# EAGLE design controller14 (EAGLE 9.3.0)

## Sheet 1 of 2
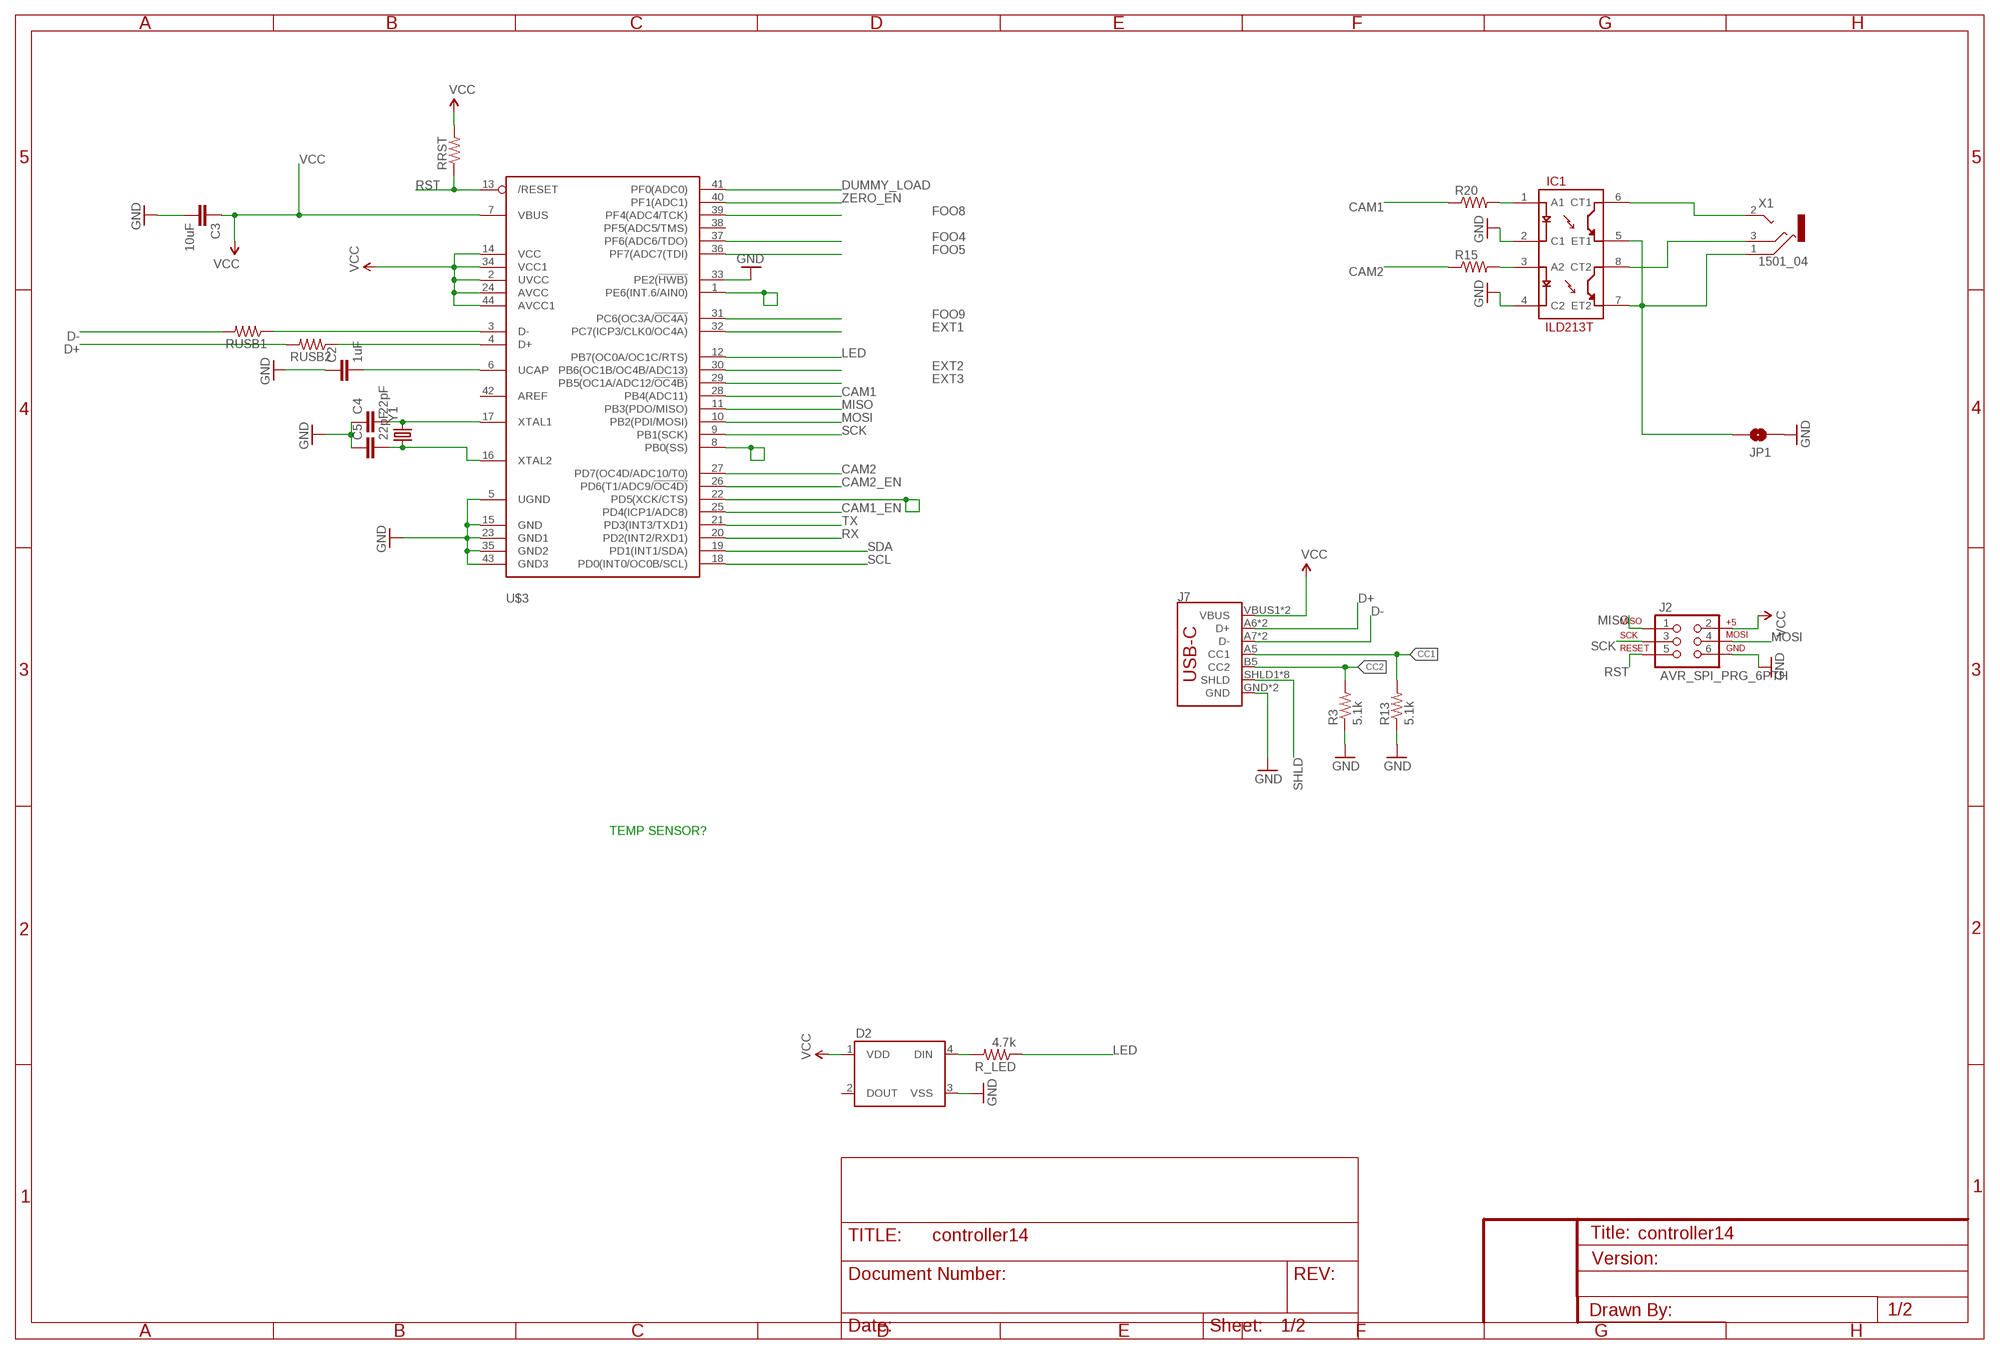
[diagram p0: schematic, sheet 1]

### Parts
C2  1uF  CAP1206  [1206]
C3  10uF  CAP1206  [1206]
C4  22pF  CAP1206  [1206]
C5  22pF  CAP1206  [1206]
D2  WS2812B  [WS2812B]
IC1  ILD213T  [SO08]
J2  AVR_SPI_PRG_6PTH  [2X3]
J7  USB_C16PIN  [USB-C-16P]
JP1  JUMPER-PAD-2-NOYES_SILK  [PAD-JUMPER-2-NO_YES_SILK]
R3  5.1k  RESISTOR1206  [1206]
R13  5.1k  RESISTOR1206  [1206]
R15  RESISTOR1206  [1206]
R20  RESISTOR1206  [1206]
R_LED  4.7k  RESISTOR1206  [1206]
RRST  RESISTOR1206  [1206]
RUSB1  RESISTOR1206  [1206]
RUSB2  RESISTOR1206  [1206]
U$3  ATMEGA32U4-AU  [TQFP44]
X1  1501_04  [1501_05]
Y1  CRYSTALCRYSTAL-SMD-5X3-16MHZ  [CRYSTAL-SMD-5X3]

### Nets
CAM1: R20.1 U$3.28(PB4(ADC11))
CAM1_EN: U$3.25(PD4(ICP1/ADC8)) ; also sheet 2
CAM2: R15.1 U$3.27(PD7(OC4D/ADC10/T0))
CAM2_EN: U$3.26(PD6(T1/ADC9/!OC4D)) ; also sheet 2
CC1: J7.A5(CC1) R13.2
CC2: J7.B5(CC2) R3.2
D+: J7.A6(D+) J7.B6(D+) RUSB2.2
D-: J7.A7(D-) J7.B7(D-) RUSB1.2
DUMMY_LOAD: U$3.41(PF0(ADC0)) ; also sheet 2
EXT1: U$3.32(PC7(ICP3/CLK0/OC4A))
EXT2: U$3.30(PB6(OC1B/OC4B/ADC13))
EXT3: U$3.29(PB5(OC1A/ADC12/!OC4B))
FOO4: U$3.37(PF6(ADC6/TDO))
FOO5: U$3.36(PF7(ADC7(TDI))
FOO8: U$3.39(PF4(ADC4/TCK))
FOO9: U$3.31(PC6(OC3A/!OC4A))
GND: C2.1 C3.2 C4.1 C5.1 D2.3(VSS) IC1.2(C1) IC1.4(C2) J2.6 J7.GND J7.GND2(GND) JP1.1 R3.1 R13.1 U$3.5(UGND) U$3.15(GND) U$3.23(GND1) U$3.33(PE2(!HWB)) U$3.35(GND2) U$3.43(GND3) ; also sheet 2
LED: R_LED.1 U$3.12(PB7(OC0A/OC1C/RTS))
MISO: J2.1 U$3.11(PB3(PDO/MISO))
MOSI: J2.4 U$3.10(PB2(PDI/MOSI))
N$4: RUSB1.1 U$3.3(D-)
N$5: RUSB2.1 U$3.4(D+)
N$7: D2.4(DIN) R_LED.2
N$8: C4.2 U$3.17(XTAL1) Y1.3
N$9: C5.2 U$3.16(XTAL2) Y1.1
N$12: IC1.6(CT1) X1.2
N$13: IC1.8(CT2) X1.3
N$14: U$3.8(PB0(SS))
N$15: IC1.3(A2) R15.2
N$16: U$3.1(PE6(INT.6/AIN0))
N$17: U$3.22(PD5(XCK/CTS))
N$19: IC1.1(A1) R20.2
N$20: C2.2 U$3.6(UCAP)
N$34: IC1.5(ET1) IC1.7(ET2) JP1.2 X1.1
RST: J2.5 RRST.1 U$3.13(/RESET)
RX: U$3.20(PD2(INT2/RXD1)) ; also sheet 2
SCK: J2.3 U$3.9(PB1(SCK))
SCL: U$3.18(PD0(INT0/OC0B/SCL))
SDA: U$3.19(PD1(INT1/SDA))
SHLD: J7.SHLD1(SHLD) J7.SHLD2(SHLD) J7.SHLD3(SHLD) J7.SHLD4(SHLD) J7.SHLD5(SHLD) J7.SHLD6(SHLD) J7.SHLD7(SHLD) J7.SHLD8(SHLD)
TX: U$3.21(PD3(INT3/TXD1)) ; also sheet 2
VCC [power]: C3.1 D2.1(VDD) J2.2 J7.VBUS1(VBUS) J7.VBUS2(VBUS) RRST.2 U$3.2(UVCC) U$3.7(VBUS) U$3.14(VCC) U$3.24(AVCC) U$3.34(VCC1) U$3.44(AVCC1) ; also sheet 2
ZERO_EN: U$3.40(PF1(ADC1)) ; also sheet 2
Unconnected: D2.2(DOUT) U$3.38(PF5(ADC5/TMS)) U$3.42(AREF)

### Notes on the sheet
- TEMP SENSOR?

## Sheet 2 of 2
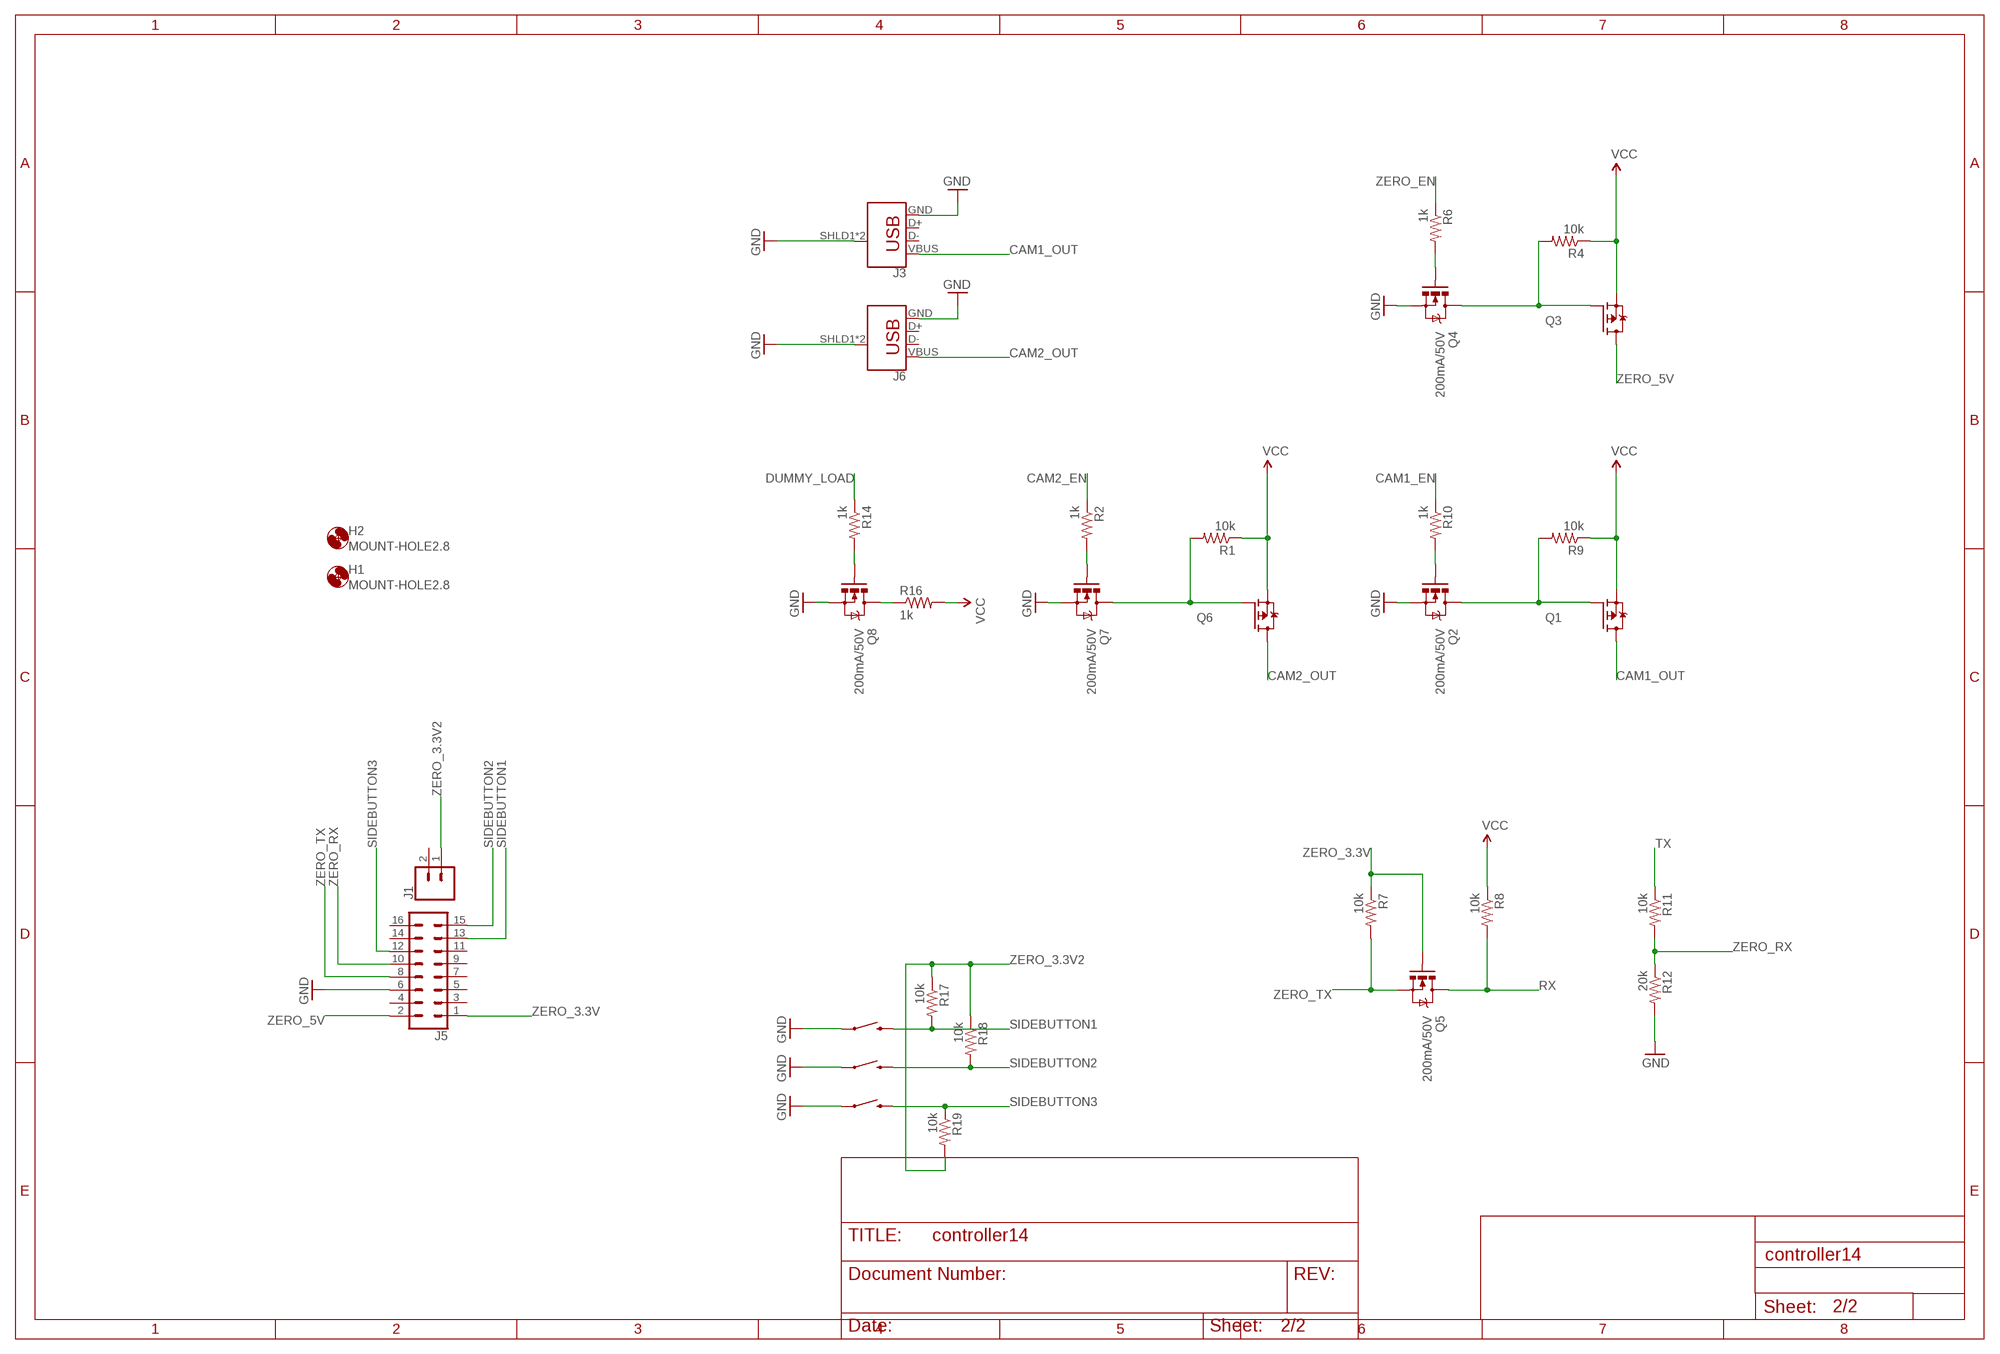
[diagram p1: schematic, sheet 2]

### Parts
H1  MOUNT-HOLE2.8  [2,8]
H2  MOUNT-HOLE2.8  [2,8]
J1  CONN_02  [1X02]
J3  USB_A_SMT_FEMALE  [USB-A-S-SILK-FEMALE]
J5  CONN_08X2  [2X8]
J6  USB_A_SMT_FEMALE  [USB-A-S-SILK-FEMALE]
Q1  FDD4141TO252  [TO252]
Q2  200mA/50V  MOSFET-NCHANNELBSS138  [SOT23-3]
Q3  FDD4141TO252  [TO252]
Q4  200mA/50V  MOSFET-NCHANNELBSS138  [SOT23-3]
Q5  200mA/50V  MOSFET-NCHANNELBSS138  [SOT23-3]
Q6  FDD4141TO252  [TO252]
Q7  200mA/50V  MOSFET-NCHANNELBSS138  [SOT23-3]
Q8  200mA/50V  MOSFET-NCHANNELBSS138  [SOT23-3]
R1  10k  RESISTOR1206  [1206]
R2  1k  RESISTOR1206  [1206]
R4  10k  RESISTOR1206  [1206]
R6  1k  RESISTOR1206  [1206]
R7  10k  RESISTOR1206  [1206]
R8  10k  RESISTOR1206  [1206]
R9  10k  RESISTOR1206  [1206]
R10  1k  RESISTOR1206  [1206]
R11  10k  RESISTOR1206  [1206]
R12  20k  RESISTOR1206  [1206]
R14  1k  RESISTOR1206  [1206]
R16  1k  RESISTOR1206  [1206]
R17  10k  RESISTOR1206  [1206]
R18  10k  RESISTOR1206  [1206]
R19  10k  RESISTOR1206  [1206]
S3  MOMENTARY-SWITCH-SPST-PTH-RIGHT-ANGLE-KIT  [TACTILE_SWITCH_PTH_RIGHT_ANGLE_KIT]
S4  MOMENTARY-SWITCH-SPST-PTH-RIGHT-ANGLE-KIT  [TACTILE_SWITCH_PTH_RIGHT_ANGLE_KIT]
S5  MOMENTARY-SWITCH-SPST-PTH-RIGHT-ANGLE-KIT  [TACTILE_SWITCH_PTH_RIGHT_ANGLE_KIT]

### Nets
CAM1_EN: R10.1 ; also sheet 1
CAM1_OUT: J3.VBUS Q1.3(D)
CAM2_EN: R2.1 ; also sheet 1
CAM2_OUT: J6.VBUS Q6.3(D)
DUMMY_LOAD: R14.1 ; also sheet 1
GND: J3.GND J3.SHLD1(SHIELD) J3.SHLD2(SHIELD) J5.6 J6.GND J6.SHLD1(SHIELD) J6.SHLD2(SHIELD) Q2.2(S) Q4.2(S) Q7.2(S) Q8.2(S) R12.2 S3.1 S4.1 S5.1 ; also sheet 1
N$1: Q1.1(G) Q2.3(D) R9.2
N$2: Q4.1(G) R6.2
N$3: Q3.1(G) Q4.3(D) R4.2
N$6: Q2.1(G) R10.2
N$10: Q8.1(G) R14.2
N$11: Q8.3(D) R16.1
N$18: Q7.1(G) R2.2
N$21: Q6.1(G) Q7.3(D) R1.2
RX: Q5.3(D) R8.2 ; also sheet 1
SIDEBUTTON1: J5.13 R17.2 S5.2
SIDEBUTTON2: J5.15 R18.2 S4.2
SIDEBUTTON3: J5.12 R19.1 S3.2
TX: R11.1 ; also sheet 1
VCC [power]: Q1.2(S) Q3.2(S) Q6.2(S) R1.1 R4.1 R8.1 R9.1 R16.2 ; also sheet 1
ZERO_3.3V: J5.1 Q5.1(G) R7.1
ZERO_3.3V2: J1.1 R17.1 R18.1 R19.2
ZERO_5V [power]: J5.2 Q3.3(D)
ZERO_EN: R6.1 ; also sheet 1
ZERO_RX: J5.10 R11.2 R12.1
ZERO_TX: J5.8 Q5.2(S) R7.2
Unconnected: J1.2 J3.D+ J3.D- J5.3 J5.4 J5.5 J5.7 J5.9 J5.11 J5.14 J5.16 J6.D+ J6.D-

## Library data of the parts
C2 = SparkFun-Capacitors:CAP: Capacitor Standard 0603 ceramic capacitor, and 0.1" leaded capacitor.
C3-C5 = SparkFun-Passives:CAP: Capacitor Standard 0603 ceramic capacitor, and 0.1" leaded capacitor.
D2 = SparkFun-LED:WS2812B: WS2812B - Intelligent control LED integrated light source Technical Specifications: Power Supply Voltage (VDD): 3.5 to 5.3 V Input Voltage (VI): -0.5 to VDD+0.5 V Operating Junction Temperature (Topt): -25°C to +80°C Storage Temperature Range (Tstg): -55°C to +150°C; PROD_ID: DIO-12503
H1 H2 = holes:MOUNT-HOLE: MOUNTING HOLE with drill center marker
IC1 = SparkFun-DiscreteSemi:ILD213T: Dual optoisolator.
J1 = SparkFun-Connectors:CONN_02: Multi connection point. Often used as Generic Header-pin footprint for 0.1 inch spaced/style header connections On any of the 0.1 inch spaced packages, you can populate with these: Break Away Headers - Straight <https://www.sparkfun.com/products/116> (PRT-00116) Break Away Male Headers - Right Angle <https://www.sparkfun.com/products/553> (PRT-00553) Female Headers <https://www.sparkfun.com/products/115> (PRT-00115) Break Away Headers - Machine Pin <https://www.sparkfun.com/products/117> (PRT-00117) Break Away Female Headers - Swiss Machine Pin <https://www.sparkfun.com/products/743> (PRT-00743) For SCREWTERMINALS and SPRING TERMINALS visit here: Screw Terimnals on SparkFun.com <https://www.sparkfun.com/search/results?term=Screw+Terminals> (5mm/3.5mm/2.54mm spacing) This device is also useful as a general connection point to wire up your design to another part of your project. Our various solder wires solder well into these plated through hole pads. Hook-Up Wire - Assortment (Stranded, 22 AWG) <https://www.sparkfun.com/products/11375> (PRT-11375) Hook-Up Wire - Assortment (Solid Core, 22 AWG) <https://www.sparkfun.com/products/11367> (PRT-11367) View the entire wire category on our website here <https://www.sparkfun.com/categories/141> Special notes: Molex polarized connector foot print use with: PRT-08233 with associated crimp pins and housings. 2.54_SCREWTERM for use with PRT-10571. 3.5mm Screw Terminal footprints for PRT-08084 5mm Screw Terminal footprints for use with PRT-08432
J2 = SparkFun-Connectors:AVR_SPI_PRG_6: AVR ISP 6 Pin This is the reduced ISP connector for AVR programming. Common on Arduino. This footprint will take up less PCB space and can be used with a 10-pin to 6-pin adapter such as SKU: BOB-08508 **Special note about "TEST_POINT" package. The stop mask is on the top side, so if you want your programming test points to be on the bottom of your board, make sure to place this package on the bottom side of the board. This also ensure that the orientation to program from the bottom side will be correct.
J3 J6 = SparkFun-Connectors:USB_A: USB-A Connector Male and female variants, as well as PTH and SMT variants SparkFun Products: SparkFun XBee Explorer Dongle <https://www.sparkfun.com/products/11697> PTH Male SparkFun MicroView-USB Programmer <https://www.sparkfun.com/products/12924> SMT Male SparkFun USB Type A Female Breakout <https://www.sparkfun.com/products/12700> SMT Female; PROD_ID: CONN-09520; SF_ID: PRT-09011
J5 = SparkFun-Connectors:CONN_08X2: Multi connection point. Often used as Generic Header-pin footprint for 0.1 inch spaced/style header connections You can populate with any combo of single row headers, but if you'd like an exact match, check this: Header - 2x8 (Male, 0.1") <https://www.sparkfun.com/products/13156> (PRT-13156) On any of the 0.1 inch spaced packages, you can populate with these: Break Away Headers - Straight <https://www.sparkfun.com/products/116> (PRT-00116) Break Away Male Headers - Right Angle <https://www.sparkfun.com/products/553> (PRT-00553) Female Headers <https://www.sparkfun.com/products/115> (PRT-00115) Break Away Headers - Machine Pin <https://www.sparkfun.com/products/117> (PRT-00117) Break Away Female Headers - Swiss Machine Pin <https://www.sparkfun.com/products/743> (PRT-00743)
J7 = SparkFun-Connectors:USB_C: USB Type C 16Pin Connector Super Speed pins not available on the 16-pin purely SMD connector so this part is best for USB 2.0 implementations. D1 and D2 are tied together enabling D+/- no matter which way the cable is plugged into the connector. The two channel configuration pins (CC1/2) are exposed. These are normally connected to ground via 5.1k resistors but can be reconfigured for high current/high power applications.; PROD_ID: CONN-14122
JP1 = SparkFun-Passives:JUMPER-PAD-2-NO
Q1 Q3 Q6 = transistor-fet:FDD4141: P-Channel PowerTrench® MOSFET Source: FDD4141.pdf
Q2 Q4 Q5 Q7 Q8 = SparkFun-DiscreteSemi:MOSFET-NCHANNEL: Common NMOSFET Parts MFG P/N Store ID Prod ID FDD8780 TRANS-09984 SI7820DN TRANS-11055 FDS6630A IC-08089 2N7002PW TRANS-11151 FQP30N06L COM-10213 TRANS-10060 BSS123LT1G TRANS-08345 BSS138 TRANS-00830 BS170 2N7000; PROD_ID: TRANS-00830
R1 R2 R4 R6-R12 R14 R16-R19 R_LED = SparkFun-Resistors:RESISTOR: Resistor Basic schematic elements and footprints for 0603, 1206, and PTH resistors.
R3 R13 R15 R20 RRST RUSB1 RUSB2 = SparkFun-Passives:RESISTOR: Resistor Basic schematic elements and footprints for 0603, 1206, and PTH resistors.
S3-S5 = SparkFun-Switches:MOMENTARY-SWITCH-SPST: Momentary Switch (Pushbutton) - SPST Normally-open (NO) SPST momentary switches (buttons, pushbuttons). Variants PTH-12MM - 12mm square, through-hole Momentary Pushbutton Switch - 12mm Square <https://www.sparkfun.com/products/9190> (COM-09190) PTH-6.0MM, PTH-6.0MM-KIT - 6.0mm square, through-hole Mini Pushbutton Switch <https://www.sparkfun.com/products/97> (COM-00097) KIT package intended for soldering kit's - only one side of pads' copper is exposed. PTH-RIGHT-ANGLE-KIT - Right-angle, through-hole Right Angle Tactile Button <https://www.sparkfun.com/products/10791> - Used on SparkFun BigTime Watch Kit <https://www.sparkfun.com/products/11734> SMD-12MM - 12mm square, surface-mount Tactile Button - SMD (12mm) <https://www.sparkfun.com/products/12993> (COM-12993) Used on SparkFun PicoBoard <https://www.sparkfun.com/products/11888> SMD-4.5MM - 4.5mm Square Trackball Switch Used on SparkFun Blackberry Trackballer Breakout <https://www.sparkfun.com/products/13169> SMD-4.6MMX2.8MM - 4.60mm x 2.80mm, surface mount Used on SparkFun SAMD21 Mini Breakout <https://www.sparkfun.com/products/13664> SMD-5.2MM, SMD-5.2-REDUNDANT - 5.2mm square, surface-mount Mini Pushbutton Switch - SMD <https://www.sparkfun.com/products/8720> (COM-08720) Used on Arduino Pro Mini <https://www.sparkfun.com/products/11114> REDUNDANT package connects both switch circuits together SMD-6.0X3.5MM - 6.0 x 3.5mm, surface mount Momentary Reset Switch SMD <https://www.sparkfun.com/products/8229> (COM-08229) SMD-6.2MM-TALL - 6.2mm square, surface mount Tactile Button - SMD (6mm) <https://www.sparkfun.com/products/12992> Used on SparkFun Digital Sandbox <https://www.sparkfun.com/products/12651> SMD-RIGHT-ANGLE - Right-angle, surface mount Used on SparkFun Block for Intel® Edison - Arduino <https://www.sparkfun.com/products/13036>; PROD_ID: CONN-10672; SF_SKU: COM-10791
U$3 = adafruit:ATMEGA32U4: http://www.ladyada.net/library/eagle
X1 = con-lumberg:1501_0*: Jack connectors according to JISC 6560, 2.5 mm Klinkensteckverbinder nach JISC 6560, 2,5 mm Source: http://www.lumberg.com/Produkte/PDFs/1501_05.pdfedit 1501_03 http://www.lumberg.com/Produkte/PDFs/1501_06.pdf; OC_FARNELL: 1216977; OC_NEWARK: unknown
Y1 = SparkFun-FreqCtrl:CRYSTAL: Various standard crystals. Proven footprints.; PROD_ID: XTAL-08218

## Net classes
0 default: width 0.254 mm, clearance 0.254 mm
1 power: width 0.381 mm, clearance 0.254 mm
2 camera_power: width 0.66 mm, clearance 0.254 mm
3 usbsignal: width 0.254 mm, clearance 0.203 mm

## Board
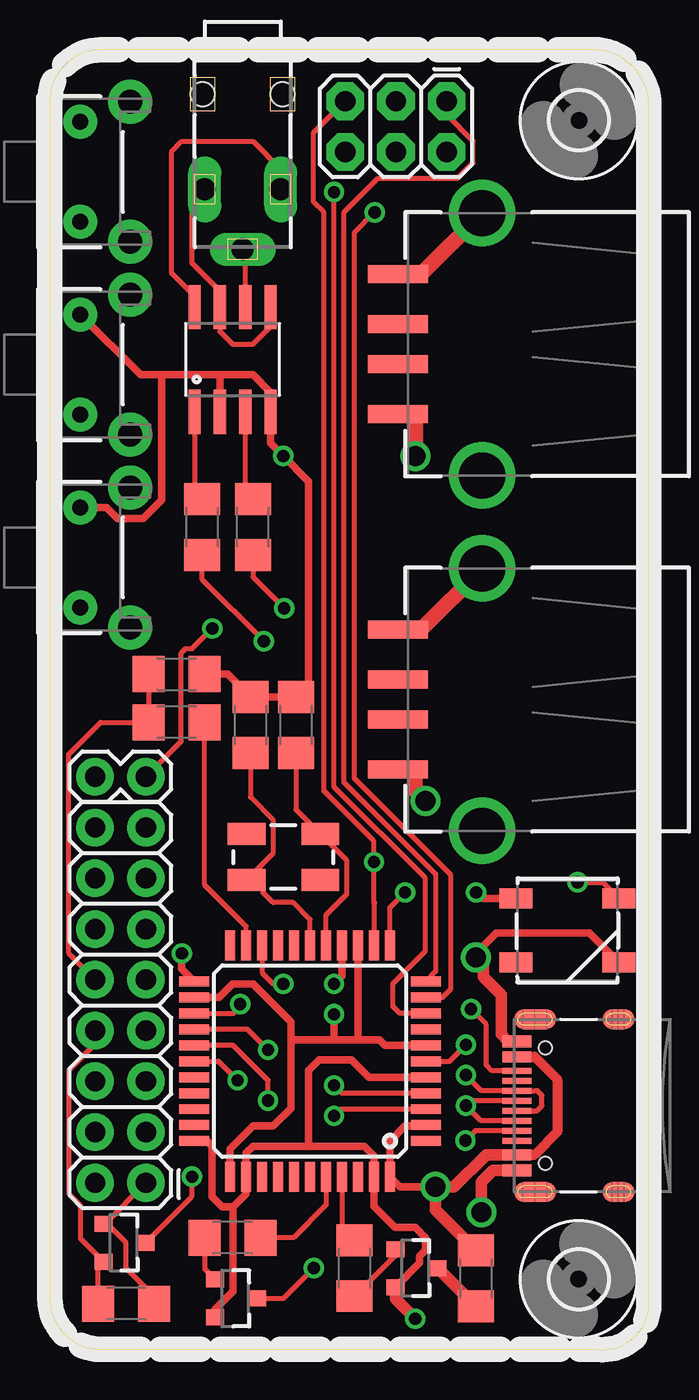
[diagram p2: board, top side]
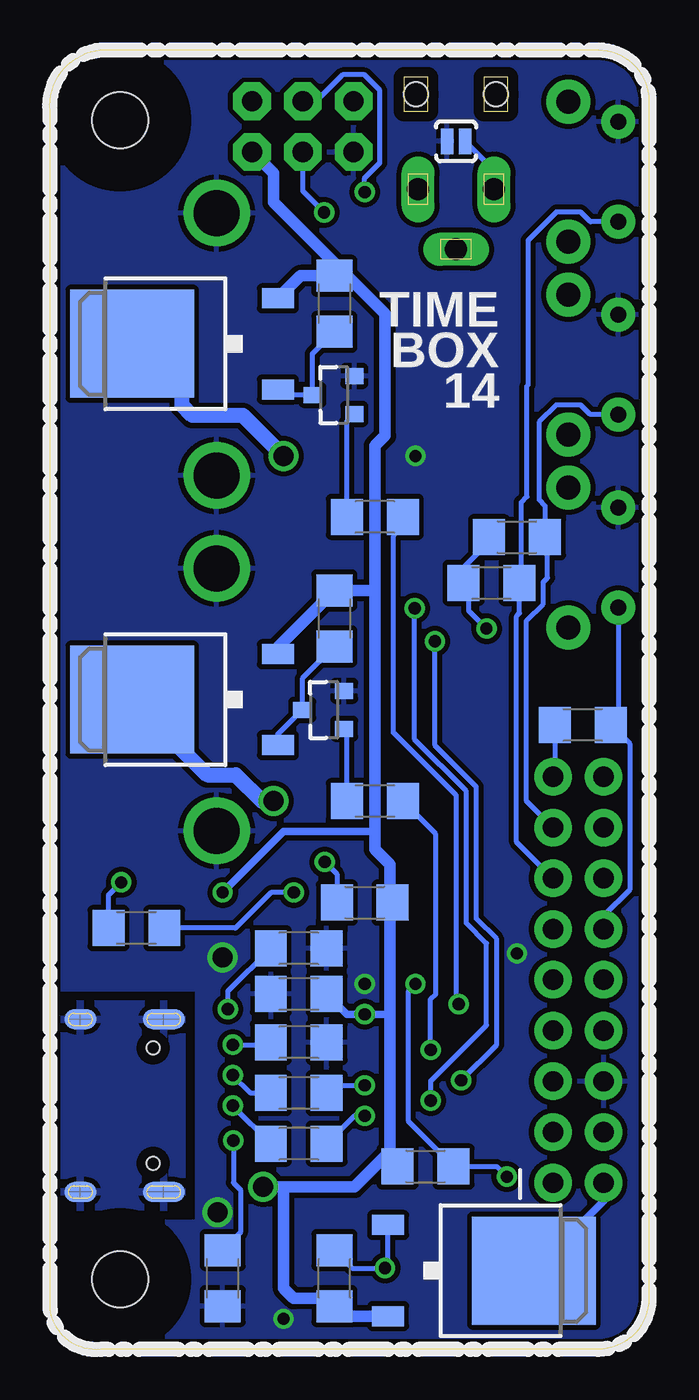
[diagram p3: board, bottom side, seen from below]

Size 29.98 x 65.04 mm. Coordinates in mm from the lower left corner, seen from the top.
Outline: 0,2.55 arc90 2.54,0.01 27.43,0.01 arc90 29.97,2.05 29.97,61.99 arc90 27.43,65.04 2.54,65.04 arc90 0,62.5 0,2.55
Copper layers (1*16): Top 0.035mm / dielectric 1.5mm / Bottom 0.035mm
Design rules "default *": minimum track width 10mil, minimum drill 24mil, track to track 8mil, track to pad 8mil, pad to pad 8mil, via to via 8mil, smd to smd 8mil, copper to edge 20mil, drill to drill 8mil, minimum pad ring 10mil, minimum via ring 8mil, stop-mask expansion 4mil, vias tented up to drill 0mil, thermal gap 10mil

### Footprints (pad centres in the part's own frame; a part is rotated, then mirrored left to right if it is on the bottom)
1206 = smd 1.6 x 1.8: 1 -1.4,0; 2 1.4,0
WS2812B = smd 1.651 x 1: 1 -2.577,1.6; 2 -2.577,-1.6; 3 2.577,-1.6; 4 2.577,1.6
2,8 = hole 2.8: 0,0
SO08 = smd 0.61 x 2.21: 1 -1.905,-2.616; 2 -0.635,-2.616; 3 0.635,-2.616; 4 1.905,-2.616; 5 1.905,2.616; 6 0.635,2.616; 7 -0.635,2.616; 8 -1.905,2.616
1X02 = drill 1.016 pad 1.88: 1 0,0; 2 2.54,0
2X3 = drill 1.016 pad 1.88 octagon: 1 0,0; 2 0,2.54; 3 2.54,0; 4 2.54,2.54; 5 5.08,0; 6 5.08,2.54
USB-A-S-SILK-FEMALE = smd 3 x 0.9: D+ 7.212,-1; D- 7.212,1; GND 7.212,-3.5; VBUS 7.212,3.5 | drill 2.311: SHLD1 3,-6.566; SHLD2 3,6.566
2X8 = drill 1.016 pad 1.88: 1 0,0; 2 0,2.54; 3 2.54,0; 4 2.54,2.54; 5 5.08,0; 6 5.08,2.54; 7 7.62,0; 8 7.62,2.54; 9 10.16,0; 10 10.16,2.54; 11 12.7,0; 12 12.7,2.54; 13 15.24,0; 14 15.24,2.54; 15 17.78,0; 16 17.78,2.54
USB-C-16P = smd 0.3 x 1.45: A5 -1.25,0; A6 -0.25,0; A7 0.25,0; A8 1.25,0; B5 1.75,0; B6 0.75,0; B7 -0.75,0; B8 -1.75,0 | smd 0.6 x 1.45: GND -3.225,0; GND2 3.225,0 | smd 1 x 2.1: SHLD1 -4.32,-0.915; SHLD2 4.32,-0.915 | smd 1 x 2.1 bottom: SHLD3 -4.32,-0.915; SHLD4 4.32,-0.915 | smd 1 x 1.6: SHLD5 -4.32,-5.095; SHLD8 4.32,-5.095 | smd 1 x 1.6 bottom: SHLD6 -4.32,-5.095; SHLD7 4.32,-5.095 | smd 0.55 x 1.45: VBUS1 -2.45,0; VBUS2 2.45,0 | hole 0.65: -2.89,-1.445; 2.89,-1.445
PAD-JUMPER-2-NO_YES_SILK = smd 0.635 x 1.27: 1 -0.45,0; 2 0.45,0
TO252 = smd 1 x 1.6: 1 -2.28,-4.8; 2 2.28,-4.8 | smd 5.4 x 6.2: 3 0,2.5
SOT23-3 = smd 0.8 x 0.9: 1 -0.95,-1; 2 0.95,-1; 3 0,1.1
TACTILE_SWITCH_PTH_RIGHT_ANGLE_KIT = drill 0.8 pad 1.7: 1 -2.5,0; 2 2.5,0 | drill 1.2 pad 2.2: ANCHOR1 -3.5,2.5; ANCHOR2 3.5,2.5
TQFP44 = smd 1.5 x 0.5: 1 -5.8,4; 2 -5.8,3.2; 3 -5.8,2.4; 4 -5.8,1.6; 5 -5.8,0.8; 6 -5.8,0; 7 -5.8,-0.8; 8 -5.8,-1.6; 9 -5.8,-2.4; 10 -5.8,-3.2; 11 -5.8,-4; 23 5.8,-4; 24 5.8,-3.2; 25 5.8,-2.4; 26 5.8,-1.6; 27 5.8,-0.8; 28 5.8,0; 29 5.8,0.8; 30 5.8,1.6; 31 5.8,2.4; 32 5.8,3.2; 33 5.8,4 | smd 0.5 x 1.5: 12 -4,-5.8; 13 -3.2,-5.8; 14 -2.4,-5.8; 15 -1.6,-5.8; 16 -0.8,-5.8; 17 0,-5.8; 18 0.8,-5.8; 19 1.6,-5.8; 20 2.4,-5.8; 21 3.2,-5.8; 22 4,-5.8; 34 4,5.8; 35 3.2,5.8; 36 2.4,5.8; 37 1.6,5.8; 38 0.8,5.8; 39 0,5.8; 40 -0.8,5.8; 41 -1.6,5.8; 42 -2.4,5.8; 43 -3.2,5.8; 44 -4,5.8
1501_05 = drill 1.1 pad 1.4 long: 1 -1.9,-8.5; 2 0,-11.5; 3 1.9,-8.5 | hole 1.2: -2,-3.75; 2,-3.75
CRYSTAL-SMD-5X3 = smd 1.9 x 1.1: 1 -1.85,-1.15; 2 1.85,-1.15; 3 1.85,1.15; 4 -1.85,1.15

### Placement (x,y rotation side)
C2  17.53,15.38 180 bottom
C3  17.53,17.79 180 bottom
C4  10.03,31.26 270 top
C5  12.32,31.26 270 top
D2  25.91,20.97 0 top
H1  26.47,3.52 0 top
H2  26.48,61.52 0 top
IC1  9.14,49.54 0 top
J1  4.8,28.66 180 top
J2  19.86,62.47 180 top
J3  24.64,50.31 180 top
J5  4.8,8.34 90 top
J6  24.64,32.53 180 top
J7  23.37,12.21 90 top
JP1  9.65,60.47 0 bottom
Q1  23.37,50.33 90 bottom
Q2  15.75,47.77 90 bottom
Q3  8.26,3.95 270 bottom
Q4  9.27,2.55 270 top
Q5  3.68,5.35 270 top
Q6  23.37,32.53 90 bottom
Q7  16.26,32.02 90 bottom
Q8  18.29,4.08 270 top
R1  15.75,36.59 270 bottom
R2  13.72,27.45 180 bottom
R3  17.53,20.08 180 bottom
R4  15.75,3.57 90 bottom
R6  9.14,5.6 180 top
R7  3.81,2.3 180 top
R8  11.18,9.16 0 bottom
R9  15.75,52.34 270 bottom
R10  13.72,41.67 180 bottom
R11  6.35,31.38 180 top
R12  6.35,33.8 0 top
R13  21.34,3.57 90 bottom
R14  15.24,4.08 270 top
R15  10.16,41.16 90 top
R16  21.34,3.57 90 top
R17  7.87,38.37 0 bottom
R18  6.6,40.65 0 bottom
R19  3.3,31.26 180 bottom
R20  7.62,41.16 90 top
R_LED  25.65,21.1 180 bottom
RRST  14.22,22.37 0 bottom
RUSB1  17.53,10.3 180 bottom
RUSB2  17.53,12.84 180 bottom
S3  1.52,39.64 270 top
S4  1.52,49.29 270 top
S5  1.52,58.94 270 top
U$3  13.02,14.43 180 top
X1  9.65,66.56 0 top
Y1  11.68,24.65 180 top

### Tracks (layer width: path | path; a pad name or v marks a point on that pad's centre or on a via)
CAM1  (via drill 0.61)
  Top 0.254: U$3.28 8.44,14.43 v9.4,13.48 | v10.71,35.45 7.62,38.54 R20.1
  Bottom 0.254: v10.71,35.45 10.71,30.24 8.64,28.16 8.64,21.56 7.62,20.54 7.62,15.25 v9.4,13.48
CAM1_EN  (via drill 0.61)
  Top 0.254: U$3.25 9.2,16.83 9.65,17.29 v9.53,17.29
  Bottom 0.254: R10.1 12.79,40.68 12.79,30.88 9.65,27.74 9.65,17.41 v9.53,17.29
CAM1_OUT  (via drill 1)
  Top 0.762: J3.VBUS 17.93,46.81 18.29,46.45 v18.29,44.72
  Bottom 0.762: Q1.3 25.4,50.33 23.37,48.3 23.37,47.26 22.86,46.75 20.32,46.75 v18.29,44.72
CAM2  (via drill 0.61)
  Top 0.254: v10.92,12.46 10.92,13.48 9.16,15.23 U$3.27 | R15.1 10.16,38.66 v11.72,37.1
  Bottom 0.254: v11.72,37.1 11.72,30.53 9.14,27.95 9.14,21.35 8.13,20.33 8.13,16.23 10.92,13.43 v10.92,12.46
CAM2_EN  (via drill 0.61)
  Top 0.254: v10.92,15 9.89,16.03 U$3.26
  Bottom 0.254: R2.1 10.67,25.8 10.67,17.79 10.92,17.54 v10.92,15
CAM2_OUT  (via drill 1)
  Top 0.584: 18.29,28.97 18.23,29.03 J6.VBUS
  Top 0.762: v18.8,27.45 18.29,27.95 18.29,28.97
  Bottom 0.762: Q6.3 22.11,28.77 20.69,28.77 19.36,27.45 v18.8,27.45
CC1  (via drill 0.61)
  Top 0.254: J7.A5 21.3,10.96 v20.8,10.46
  Bottom 0.254: v20.8,10.46 20.8,8.35 20.45,8 20.45,5.86 R13.2
CC2  (via drill 0.61)
  Top 0.254: J7.B5 22.13,13.96 21.84,14.24 21.84,16.27 v21.08,17.03
  Bottom 0.254: v21.08,17.03 21.08,17.92 R3.2
D+  (via drill 0.61)
  Top 0.254: v20.83,13.73 21.6,12.96 J7.B6 24.28,12.96 24.37,12.96 24.38,12.97 24.64,12.71 24.64,12.21 24.39,11.96 J7.A6
  Bottom 0.254: v20.83,13.73 19.94,12.84 RUSB2.2
D-  (via drill 0.61)
  Top 0.254: J7.B7 21.58,11.46 v20.83,12.21 21.08,12.46 J7.A7
  Bottom 0.254: v20.83,12.21 v20.83,12.2 RUSB1.2
DUMMY_LOAD
  Top 0.254: U$3.41 14.62,5.71 14.86,5.48 R14.1
GND  (via drill 0.61, 1)
  Top 0.381: Q4.2 8.27,2.02 9.16,2.92 9.16,7.15 | 9.16,7.15 9.82,7.8 U$3.35 9.82,9.84 10.16,10.17 12.95,10.17 | Q8.2 18.49,4.33 18.49,4.66 18.8,4.96 18.8,5.6 18.29,6.11 17.27,6.11 16.22,7.16 U$3.43 16.22,9.7 15.75,10.17 12.95,10.17 | 12.95,10.17 12.95,13.98 13.46,14.49 15.1,14.49 15.96,13.63 U$3.5 | 28.48,19.04 D2.3 | 9.16,7.15 8.61,7.15 8.13,7.63 8.13,10.17 7.87,10.43 U$3.33 | R12.2 8.89,33.8 C4.1 C5.1 12.95,33.29 12.95,43.45 v11.68,44.72 11.05,45.35 IC1.4 11.05,47.89 10.16,48.78 9.14,48.78 8.51,48.78 | S3.1 2.84,42.14 3.38,41.59 4.66,41.59 5.59,42.52 5.59,48.78 | IC1.2 8.51,48.78 | S4.1 4.53,48.78 5.59,48.78 | D2.3 28.23,19.37 | U$3.23 6.6,19.05 v6.6,19.83 | U$3.15 14.62,18.7 v14.22,18.3 | D2.3 27.01,20.84 22.35,20.84 21.34,19.83 v21.34,19.63 | 5.59,48.78 8.51,48.78
  Top 0.584: Q8.2 17.29,2.54 v18.29,1.54 | v21.59,6.87 21.59,8.4 22.18,8.98 J7.GND | v21.34,19.63 21.7,19.26 21.7,18.64 22.61,17.74 22.61,15.76 22.94,15.43 J7.GND2
  Top 0.762: J3.GND 18.57,53.81 J3.SHLD1 | J6.GND 18.57,36.03 J6.SHLD1
  pour Bottom: 29.84,0.01 0,0.01 0,69.1 3.76,65.34 29.85,65.04 29.97,18.05 22.61,18.05 22.61,6.36 29.97,6.36 29.97,0.14
LED  (via drill 0.61)
  Top 0.254: U$3.12 17.02,22.12 v17.78,22.87
  Bottom 0.254: R_LED.1 20.7,21.1 18.92,22.87 v17.78,22.87
MISO
  Top 0.254: U$3.11 19.3,18.91 19.3,23.8 14.73,28.37 14.73,56.91 16.26,58.43 16.43,58.61 20.41,58.61 21.18,59.39 21.18,60.48 19.86,61.8 J2.1
MOSI  (via drill 0.61)
  Top 0.254: U$3.10 19.65,17.63 20.07,18.05 20.07,23.76 15.24,28.58 15.24,55.89 v16.26,56.91
  Bottom 0.254: v16.26,56.91 17.32,57.98 J2.4
N$1
  Bottom 0.254: R9.2 16.85,49.84 Q2.3 18.28,47.77 Q1.1
N$2
  Top 0.254: R6.2 7.74,4.03 Q4.1
N$3  (via drill 0.61)
  Top 0.254: Q4.3 11.68,2.55 v13.21,4.08
  Bottom 0.254: R4.2 14.86,4.08 v13.21,4.08 13.05,4.23 Q3.1
N$4  (via drill 0.61)
  Top 0.254: U$3.3 14.56,12.03 v14.22,11.7
  Bottom 0.254: RUSB1.1 14.73,11.7 v14.22,11.7
N$5  (via drill 0.61)
  Top 0.254: U$3.4 14.61,12.83 v14.22,13.22
  Bottom 0.254: RUSB2.1 15.74,13.22 v14.22,13.22
N$6
  Bottom 0.254: R10.2 15.12,46.45 Q2.1
N$7  (via drill 0.61)
  Top 0.254: v26.42,23.38 27.67,23.38 D2.4
  Bottom 0.254: R_LED.2 27.05,22.74 v26.42,23.38
N$8
  Top 0.254: U$3.17 13.02,21.54 12.19,22.37 11.18,22.37 10.67,22.87 10.67,23.38 10.55,23.5 Y1.3 11.16,24.83 11.16,26.51 10.03,27.64 C4.2
N$9
  Top 0.254: U$3.16 13.82,21.75 14.87,22.79 14.87,24.47 Y1.1 12.32,27.02 C5.2
N$10
  Top 0.254: R14.2 17.29,4.73 Q8.1
N$11
  Top 0.584: R16.1 19.43,4.08 Q8.3
N$12
  Top 0.254: X1.2 9.78,54.93 IC1.6
N$13
  Top 0.254: IC1.8 7.24,52.72 6.1,53.86 6.1,59.96 6.6,60.47 10.16,60.47 11.55,59.07 X1.3
N$15
  Top 0.254: IC1.3 9.78,42.94 R15.2
N$18
  Bottom 0.254: R2.2 15.12,30.93 Q7.1
N$19
  Top 0.254: IC1.1 7.24,42.94 R20.2
N$20  (via drill 0.61)
  Top 0.254: U$3.6 20.01,14.43 v20.83,15.25
  Bottom 0.254: v20.83,15.25 19.05,15.25 C2.2
N$21
  Bottom 0.254: Q6.1 18.57,30.81 Q7.3 17.36,33.58 R1.2
N$34
  Top 0.254: IC1.5 11.18,52.03 11.18,51.32 10.16,50.31 9.14,50.31 8.51,50.94 IC1.7 8.51,52.97 7.11,54.37 7.11,57.42 X1.1
  Bottom 0.254: JP1.2 7.75,59.02 X1.1
RST  (via drill 0.61)
  Top 0.254: U$3.13 16.26,20.27 16.26,22.37 16.22,22.4 v16.22,24.4 16.22,25.45 13.72,27.95 13.72,56.91 13.21,57.42 13.21,60.9 J2.5
  Bottom 0.254: v16.22,24.4 15.62,23.8 RRST.1
RX  (via drill 0.61)
  Top 0.254: Q5.3 7.11,7.68 v7.11,8.65 | U$3.20 10.62,18.86 11.18,18.3 v11.68,18.3
  Bottom 0.254: v7.11,8.65 7.62,9.16 R8.2 12.03,11.41 12.03,17.96 v11.68,18.3
SCK  (via drill 0.61)
  Top 0.254: U$3.9 17.52,16.83 17.17,17.18 17.18,17.2 17.18,18.33 18.8,19.95 18.8,23.59 14.22,28.16 v14.22,57.93
  Bottom 0.254: v14.22,57.93 14.22,58.62 13.46,59.39 13.46,63.02 14.24,63.79 15.33,63.79 16.65,62.47 J2.3
SHLD
  pour Bottom: 29.97,17.29 23.37,17.29 23.37,7.13 29.97,7.13
SIDEBUTTON1
  Bottom 0.254: S5.2 2.93,56.44 3.41,56.92 4.64,56.92 6.05,55.5 6.05,48.27 6.1,48.23 6.1,42.69 6.38,42.4 6.38,38.46 R17.2 6.47,36.85 6.63,36.69 6.63,25.41 J5.13
SIDEBUTTON2
  Bottom 0.254: S4.2 2.93,46.79 3.41,47.27 4.64,47.27 5.5,46.4 5.5,42.52 5.2,42.22 R18.2 5.08,40.53 5.08,38.62 5.29,38.41 5.29,37.31 6.12,36.48 6.12,27.45 J5.15
SIDEBUTTON3
  Bottom 0.254: J5.12 2.26,21.72 0.94,23.04 0.94,30.29 R19.1 2.09,31.45 1.52,32.02 S3.2
TX
  Top 0.254: U$3.21 9.82,21.18 7.75,23.25 R11.1
VCC  (via drill 0.61, 1)
  Top 0.381: U$3.2 18.86,11.19 17.78,11.19 17.02,10.43 U$3.44 17.51,8.14 v19.3,8.14 | U$3.34 9.02,10.05 10.16,11.19 11.18,11.19 12.06,12.08 12.06,15.51 | U$3.24 8.47,17.63 9.14,18.3 10.16,18.3 12.06,16.4 12.06,15.51 | D2.1 21.64,22.57 v21.34,22.87 | U$3.7 16.79,15.23 16.51,15.51 15.42,15.51 | 12.06,15.51 14.22,15.51 | 14.22,15.51 15.42,15.51 | U$3.14 15.42,15.51 | 14.22,15.51 v14.22,16.78
  Top 0.508: J7.VBUS1 24.27,9.76 25.4,10.88 25.4,13.53 24.27,14.66 J7.VBUS2
  Top 0.584: J7.VBUS1 21.84,9.76 20.23,8.14 v19.3,8.14 19.3,7 R16.2
  Bottom 0.381: RRST.2 12.95,22.37 | v21.34,22.87 18.29,25.92 13.72,25.92 | 12.95,16.78 v14.22,16.78 15.11,16.78 C3.1
  Bottom 0.584: v19.3,8.14 18.29,8.14 | 18.29,8.14 14.73,8.14 12.95,9.92 | 12.95,9.92 12.95,9.16 R8.1 | 12.95,9.92 12.95,16.78 12.95,22.37 12.95,24.27 13.72,25.04 13.72,25.92 13.72,37.99 | Q3.2 15.25,1.67 R4.1 16.13,2.55 17.78,2.55 18.29,3.06 18.29,8.14 | 13.72,37.99 R1.1 18.57,35.17 Q6.2 | 13.72,37.99 13.72,45.23 13.21,45.73 13.21,51.83 15.12,53.74 R9.1 | Q1.2 17.44,53.74 R9.1 | R9.1 15.75,54.37 18.8,57.42 18.8,58.87 J2.2
ZERO_3.3V
  Top 0.254: Q5.1 2.75,6.3 2.81,6.35 | 2.81,6.35 J5.1 | R7.1 5.21,2.68 3.81,4.08 3.81,5.35 2.81,6.35
ZERO_3.3V2  (via drill 0.61)
  Top 0.254: J1.1 6.57,30.43 6.57,34.85 6.79,35.08 7.12,35.08 v8.13,36.08
  Bottom 0.254: R18.1 7.87,40.52 9.27,39.12 R17.1 9.02,38.11 9.02,36.97 v8.13,36.08 | R19.2 4.7,28.76 J1.1
ZERO_5V
  Bottom 0.381: Q3.3 2.26,7.44 J5.2
ZERO_EN
  Top 0.254: U$3.40 13.82,7.23 12.19,5.6 R6.1
ZERO_RX
  Top 0.254: J5.10 0.94,19.83 0.94,29.78 2.54,31.38 R11.2 R12.1
ZERO_TX
  Top 0.254: R7.2 2.41,4.12 Q5.2 1.52,5.56 1.52,7.21 0.94,7.8 0.94,13.97 2.26,15.29 J5.8

### Text on the board
bPlace: TIME | BOX | 14